# Altium schematic sheet Sheet1.SchDoc
size A4; SheetNumber: 1; SheetTotal: 1; SPICEModelCacheXIDEHVSZ: <root> / <DocumentId>XIDEHVSZ</DocumentId> / </root>
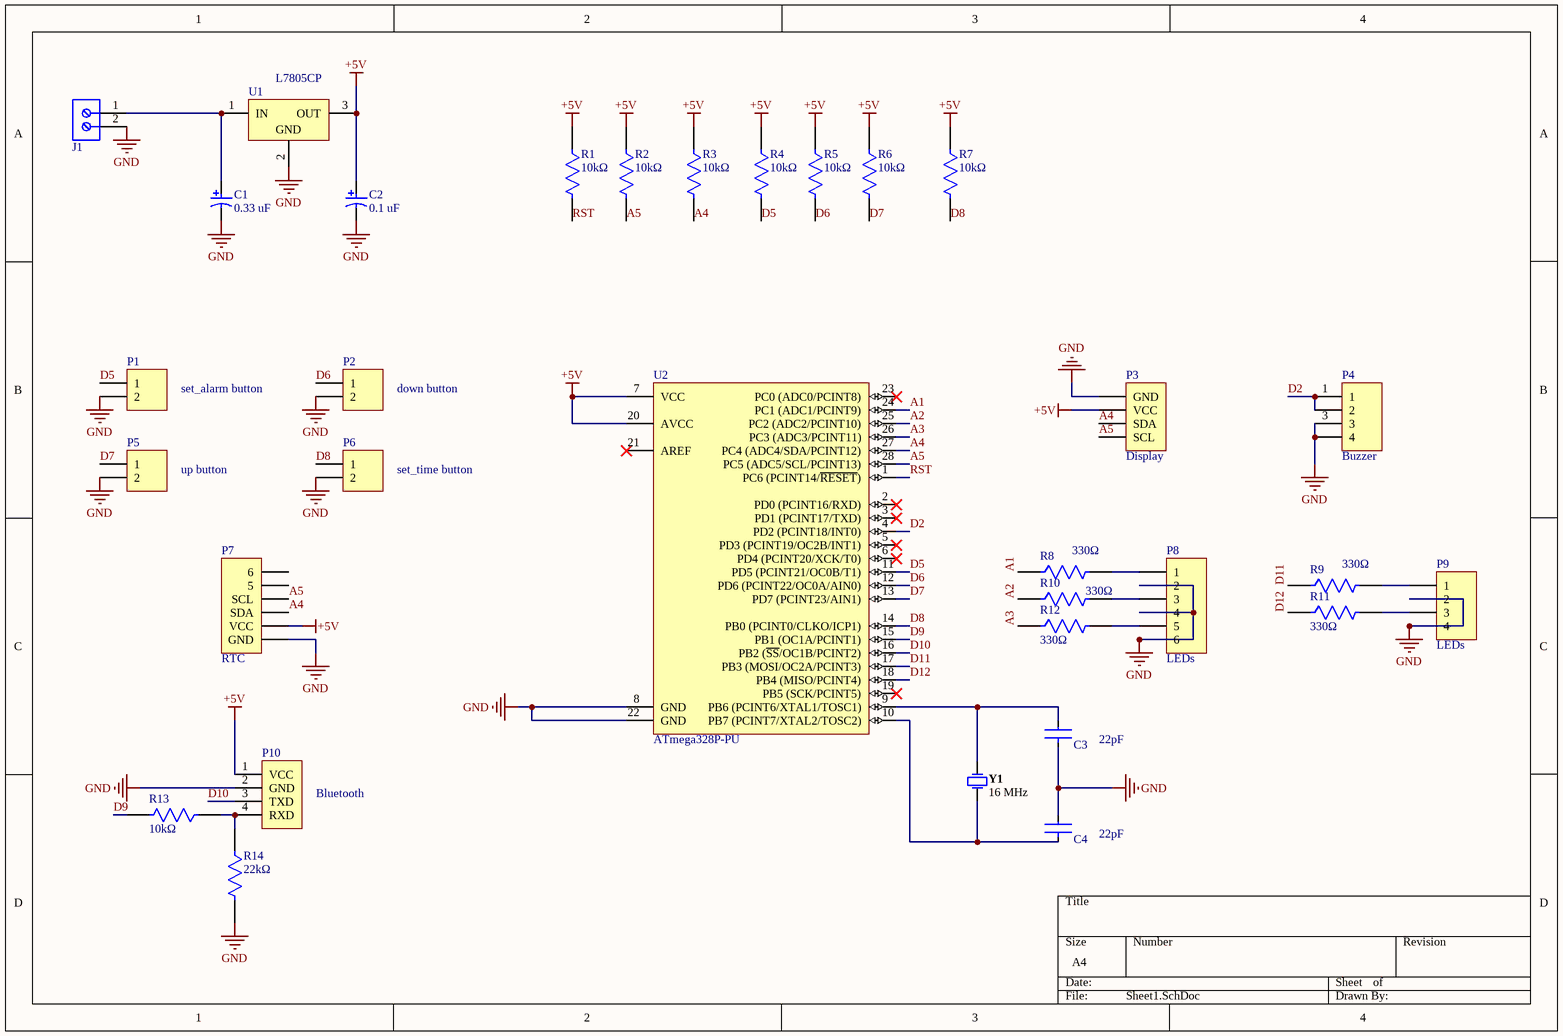
[diagram p0: Sheet1.SchDoc]

## Parts
C1  Rated Capacitance: 0.33 uF  [NIC-PLF-10x13-2_V]  (hidden comment: PLF1A471MDO1_big)
C2  Rated Capacitance: 0.1 uF  [NIC-PLF-10x13-2_V]  (hidden comment: PLF1A471MDO1_big)
C3  Capacitance: 22pF  [FP-RDE0M1-MFG]  (hidden comment: RDE5C1H220J0K1H03B)
C4  Capacitance: 22pF  [FP-RDE0M1-MFG]  (hidden comment: RDE5C1H220J0K1H03B)
J1  691102710002  [691102710002]  (value not drawn)
P1  set_alarm button  [HDR1X2]
P2  down button  [HDR1X2]
P3  Display  [HDR1X4]
P4  Buzzer  [HDR1X4]
P5  up button  [HDR1X2]
P6  set_time button  [HDR1X2]
P7  RTC  [HDR1X6]
P8  LEDs  [HDR1X6]
P9  LEDs  [HDR1X4]
P10  Bluetooth  [HDR1X4]
R1  Resistance: 10kΩ  [FP-MFR-25-MFG]  (hidden comment: MFR-25FBF52-1K18)
R2  Resistance: 10kΩ  [FP-MFR-25-MFG]  (hidden comment: MFR-25FBF52-1K18)
R3  Resistance: 10kΩ  [FP-MFR-25-MFG]  (hidden comment: MFR-25FBF52-1K18)
R4  Resistance: 10kΩ  [FP-MFR-25-MFG]  (hidden comment: MFR-25FBF52-1K18)
R5  Resistance: 10kΩ  [FP-MFR-25-MFG]  (hidden comment: MFR-25FBF52-1K18)
R6  Resistance: 10kΩ  [FP-MFR-25-MFG]  (hidden comment: MFR-25FBF52-1K18)
R7  Resistance: 10kΩ  [FP-MFR-25-MFG]  (hidden comment: MFR-25FBF52-1K18)
R8  Resistance: 330Ω  [FP-MFR-25-MFG]  (hidden comment: MFR-25FBF52-1K18)
R9  Resistance: 330Ω  [FP-MFR-25-MFG]  (hidden comment: MFR-25FBF52-1K18)
R10  Resistance: 330Ω  [FP-MFR-25-MFG]  (hidden comment: MFR-25FBF52-1K18)
R11  Resistance: 330Ω  [FP-MFR-25-MFG]  (hidden comment: MFR-25FBF52-1K18)
R12  Resistance: 330Ω  [FP-MFR-25-MFG]  (hidden comment: MFR-25FBF52-1K18)
R13  Resistance: 10kΩ  [FP-MFR-25-MFG]  (hidden comment: MFR-25FBF52-1K18)
R14  Resistance: 22kΩ  [FP-MFR-25-MFG]  (hidden comment: MFR-25FBF52-1K18)
U1  L7805CP  [TO220FP]
U2  ATmega328P-PU  [28P3]
Y1  16 MHz  [FOX-FOXSLF160-20]

## Nets
+5V: C2.1 P3.2(VCC) P7.2(VCC) P10.1(VCC) R1.1 R2.1 R3.1 R4.1 R5.1 R6.1 R7.1 U1.3(OUT) U2.7(VCC) U2.20(AVCC)
GND: C1.2 C2.2 C3.1 C4.2 J1.2 P1.2 P2.2 P3.1(GND) P4.3 P4.4 P5.2 P6.2 P7.1(GND) P8.2 P8.4 P8.6 P9.2 P9.4 P10.2(GND) R14.2 U1.2(GND) U2.8(GND) U2.22(GND)
A1: R8.1 U2.24(PC1_(ADC1/PCINT9))
A2: R10.1 U2.25(PC2_(ADC2/PCINT10))
A3: R12.1 U2.26(PC3_(ADC3/PCINT11))
A4: P3.3(SDA) P7.3(SDA) R3.2 U2.27(PC4_(ADC4/SDA/PCINT12))
A5: P3.4(SCL) P7.4(SCL) R2.2 U2.28(PC5_(ADC5/SCL/PCINT13))
D2: P4.1 P4.2 U2.4(PD2_(PCINT18/INT0))
D5: P1.1 R4.2 U2.11(PD5_(PCINT21/OC0B/T1))
D6: P2.1 R5.2 U2.12(PD6_(PCINT22/OC0A/AIN0))
D7: P5.1 R6.2 U2.13(PD7_(PCINT23/AIN1))
D8: P6.1 R7.2 U2.14(PB0_(PCINT0/CLKO/ICP1))
D9: R13.2 U2.15(PB1_(OC1A/PCINT1))
D10: P10.3(TXD) U2.16(PB2_(~{SS}/OC1B/PCINT2))
D11: R9.1 U2.17(PB3_(MOSI/OC2A/PCINT3))
D12: R11.1 U2.18(PB4_(MISO/PCINT4))
RST: R1.2 U2.1(PC6_(PCINT14/~{RESET}))
NetC1_1: C1.1 J1.1 U1.1(IN)
NetC3_2: C3.2 U2.9(PB6_(PCINT6/XTAL1/TOSC1)) Y1.1
NetC4_1: C4.1 U2.10(PB7_(PCINT7/XTAL2/TOSC2)) Y1.2
NetP8_1: P8.1 R8.2
NetP8_3: P8.3 R10.2
NetP8_5: P8.5 R12.2
NetP9_1: P9.1 R9.2
NetP9_3: P9.3 R11.2
NetP10_4: P10.4(RXD) R13.1 R14.1

Not connected (* = marked no-connect by the designer): P7 5 6; U2 2(PD0_(PCINT16/RXD))* 3(PD1_(PCINT17/TXD))* 5(PD3_(PCINT19/OC2B/INT1))* 6(PD4_(PCINT20/XCK/T0))* 19(PB5_(SCK/PCINT5))* 21(AREF)* 23(PC0_(ADC0/PCINT8))*

## Library data of the parts
C1 C2 = CMP-1234-00001-1: Aluminum Electrolytic Capacitor, 470 uF +/-20%, 10 V, -55 to 105 degC, 2-Pin THD, RoHS; Manufacturer: Nichicon; Leakage Current: 0.94 mA; Rated Ripple: 5700 mA; Rated Voltage: 10 V; ComponentLink3URL: http://nichicon-us.com/english/products/pdfs/e-lf.pdf; PackageDescription: 2-Pin Through Hole Device, Dia 10 mm, Body Length 13 mm, Pin Spacing 5 mm; ComponentLink2URL: http://nichicon-us.com/english/products/pdfs/e-lf.pdf; RoHS: TRUE; ComponentLink1URL: http://www.nichicon.co.jp/; ComponentLink2Description: Datasheet; Capacitance Tolerance: +/-20%; ComponentLink1Description: Manufacturer URL; Mounting Technology: Through Hole; ComponentLink3Description: Package Specification; Temperature Range: -55 to 105 degC; DatasheetVersion: Sep-13; PartNumber: PLF1A471MDO1
C3 C4 = CMP-06035-055552-1: Ceramic Capacitor 22pF ±5% 50V C0G Radial; Lead Diameter: 0.5mm; Width: 0.098inch; Dielectric: C0G; Length: 0.157inch; Max Operating Temperature: 125°C; Case/Package: Radial; Voltage Rating (DC): 50V; Lead Free: Lead Free; Voltage Rating: 50V; Termination: Radial; Mount: Through Hole; Tolerance: 5%; Resistor Type: Ceramic; Packaging: Bulk; Package Quantity: 500; Lead Pitch: 0.197inch; Min Operating Temperature: -55°C; Height - Seated (Max): 0.236inch; Height: 3.5mm
J1 = CMP-1502-03258-1: Series 102 - 5.00 mm Horizontal Entry Modular with Pressure Clamp WR-TBL, 2 pin; Manufacturer: Wurth Elektronik; Pin Number: 2; Pitch: 5.00mm; Manufacturer URL: http://www.we-online.de; Mounting Technology: THT; Publisher: WurthElektronik; Packaging: Box; Package Reference: 691102710002; Datasheet URL: http://katalog.we-online.de/em/datasheet/6911027100xx.pdf; Operating Temperature: -40to105degC; Part Number: 691102710002
P1 P2 P5 P6 = Header 2: Header, 2-Pin; LatestRevisionDate: 17-Jul-2002; LatestRevisionNote: Re-released for DXP Platform.; Publisher: Altium Limited
P3 P4 P9 P10 = Header 4: Header, 4-Pin; LatestRevisionDate: 17-Jul-2002; LatestRevisionNote: Re-released for DXP Platform.; Publisher: Altium Limited
P7 P8 = Header 6: Header, 6-Pin; LatestRevisionDate: 17-Jul-2002; LatestRevisionNote: Re-released for DXP Platform.; Publisher: Altium Limited
R1-R7 R13 = CMP-03413-000001-1: RES 1.18K OHM 1/4W 1% AXIAL; Manufacturer: Yageo; Value: 10kΩ; Temperature Coefficient: 100ppm/°C; Power Rating: 0.25W; Voltage Rating: 250V; Temperature: -55°C to +155°C; Automotive: No; Temperature Range High: +155°C; Mouser Description: Metal Film Resistors 1.18K OHM 1/4W 1%; Digikey Description: RES 1.18K OHM 1/4W 1% AXIAL; Lead Free: Yes; Tolerance: 1%; ComponentLink2Description: Datasheet; ComponentLink2URL: https://www.yageo.com/upload/media/product/products/datasheet/lr/Yageo_LR_MFR_1.pdf; Temperature Range Low: -55°C; Package: MFR-25; Ipc Land Pattern Name: RESAD1000W75L680D260; Composition: Metal Film; Category: Res; Octopart: https://octopart.com/mfr-25fbf52-1k18-yageo-56251681; Series: MFR; Device Class L2: Resistors; Height: 2.6mm; Device Class L3: Through-Hole Resistors; Manufacturer Part Number: MFR-25FBF52-1K18; RoHS: TRUE; Device Class L1: Passive Components
R8-R12 = CMP-03413-000001-1: RES 1.18K OHM 1/4W 1% AXIAL; Manufacturer: Yageo; Value: 330Ω; Temperature Coefficient: 100ppm/°C; Power Rating: 0.25W; Voltage Rating: 250V; Temperature: -55°C to +155°C; Automotive: No; Temperature Range High: +155°C; Mouser Description: Metal Film Resistors 1.18K OHM 1/4W 1%; Digikey Description: RES 1.18K OHM 1/4W 1% AXIAL; Lead Free: Yes; Tolerance: 1%; ComponentLink2Description: Datasheet; ComponentLink2URL: https://www.yageo.com/upload/media/product/products/datasheet/lr/Yageo_LR_MFR_1.pdf; Temperature Range Low: -55°C; Package: MFR-25; Ipc Land Pattern Name: RESAD1000W75L680D260; Composition: Metal Film; Category: Res; Octopart: https://octopart.com/mfr-25fbf52-1k18-yageo-56251681; Series: MFR; Device Class L2: Resistors; Height: 2.6mm; Device Class L3: Through-Hole Resistors; Manufacturer Part Number: MFR-25FBF52-1K18; RoHS: TRUE; Device Class L1: Passive Components
R14 = CMP-03413-000001-1: RES 1.18K OHM 1/4W 1% AXIAL; Manufacturer: Yageo; Value: 22kΩ; Temperature Coefficient: 100ppm/°C; Power Rating: 0.25W; Voltage Rating: 250V; Temperature: -55°C to +155°C; Automotive: No; Temperature Range High: +155°C; Mouser Description: Metal Film Resistors 1.18K OHM 1/4W 1%; Digikey Description: RES 1.18K OHM 1/4W 1% AXIAL; Lead Free: Yes; Tolerance: 1%; ComponentLink2Description: Datasheet; ComponentLink2URL: https://www.yageo.com/upload/media/product/products/datasheet/lr/Yageo_LR_MFR_1.pdf; Temperature Range Low: -55°C; Package: MFR-25; Ipc Land Pattern Name: RESAD1000W75L680D260; Composition: Metal Film; Category: Res; Octopart: https://octopart.com/mfr-25fbf52-1k18-yageo-56251681; Series: MFR; Device Class L2: Resistors; Height: 2.6mm; Device Class L3: Through-Hole Resistors; Manufacturer Part Number: MFR-25FBF52-1K18; RoHS: TRUE; Device Class L1: Passive Components
U1 = CMP-0244-00474-1: Positive Voltage Regulator, 5V, 3-Pin TO-220FP; ComponentLink1Description: Manufacturer URL; ComponentLink2Description: Datasheet; DatasheetVersion: 16/11/2011; PackageDescription: TO, Thru-Hole, Vertical, Heatsink Mounted; 3 In-Line Leads; Pitch 2.54 mm; ComponentLink2URL: http://www.st.com/internet/com/TECHNICAL_RESOURCES/TECHNICAL_LITERATURE/DATASHEET/CD00000444.pdf; ComponentLink1URL: http://www.st.com; PackageVersion: 2011; PackageReference: TO220FP
U2 = CMP-0095-00013-2: 8-bit AVR Microcontroller, 32KB Flash, 1KB EEPROM, 2KB SRAM, 28-pin PDIP, Industrial Grade (-40°C to 85°C); RevisionNote: DatasheetVersion updated. URLs added.; PackageVersion: revB, Sep-2001; PackageDescription: 28-lead (0.300"/7.62mm Wide) Plastic Dual Inline Package (PDIP); DatasheetVersion: revD, May-2011; ComponentLink1Description: Manufacturer URL; ComponentLink1URL: http://www.atmel.com/; PackageReference: 28P3; ComponentLink2Description: ATmega48A/48PA/88A/88PA/168A/168PA/328/328P Datasheet; ComponentLink3URL: http://www.atmel.com/dyn/resources/prod_documents/8271S.pdf; ComponentLink2URL: http://www.atmel.com/dyn/resources/prod_documents/8271.pdf; ComponentLink3Description: ATmega48A/48PA/88A/88PA/168A/168PA/328/328P Summary
Y1 = CMP-1749-00003-1: Resistance Weld Thru-Hole Crystal, 16 MHz, -20 to 70 degC, 2-Pin THD, RoHS, Bulk; Voltage Rating: 250 V; Tolerance: 1%; Resistance: 221 kohm; Case\Package: Axial; Power Rating: 250 mW; RoHSCompliant: true; Package Quantity: 200; Packaging: Bulk; Min Operating Temperature: -55 degC; DatasheetVersion: Mar-15; ComponentLink1URL: http://www.foxonline.com/; Max Operating Temperature: 155 degC; PackageReference: FOXSLF160-20; Mount: Through Hole; PackageDescription: 2-Pin Through Hole Device, Body 11.35 x 4.65 mm; ComponentLink1Description: Manufacturer URL; ComponentLink2URL: http://www.foxonline.com/pdfs/hc49slf.pdf; ComponentLink2Description: Datasheet; Length: 0.248 inch